# Altium schematic sheet XTAL.SchDoc
size A
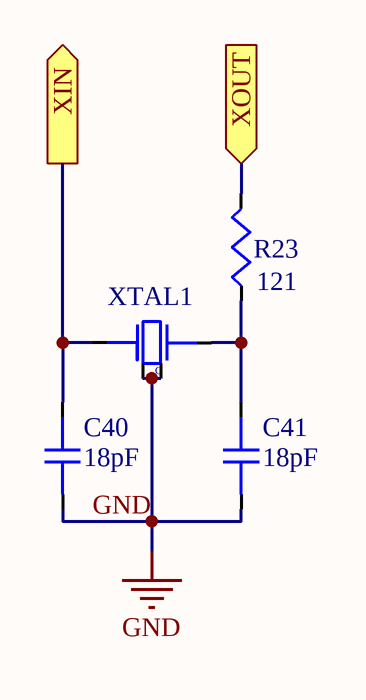
[diagram p0: XTAL.SchDoc]

## Parts
C40  18pF  [C0603]
C41  18pF  [C0603]
R23  121  [R0603]
XTAL1  ECS-192-12-33-AGM-TR  [XTAL_ECS-192-12-33-AGM-TR]  (value not drawn)

## Ports
XIN (out), XOUT (in)

## Nets
GND: C40.1 C41.1 XTAL1.2 XTAL1.4
XIN: C40.2 XTAL1.1 ; port XIN
XOUT: R23.2 ; port XOUT
NetC41_2: C41.2 R23.1 XTAL1.3

## Notes on the sheet
- (in symbol ECS-192-12-33-AGM-TR) G

## Library data of the parts
C40 C41 = 06035A190FAT2A: Multilayer Ceramic Capacitors MLCC - SMD/SMT 50V 18pF C0G 0603 1% Tol; Capacitance: 36pF; Supplier 1: Digi-Key; Supplier Part Number 1: 478-10293-1-ND; RoHS: Yes; Mount: Surface Mount; Case/Package: 0603; Case Code (Imperial): 0603; Case Code (Metric): 1608; Min Operating Temperature: -55°C; Max Operating Temperature: 125°C; Tolerance: 1%; Dielectric: C0G; Packaging: Tape and Reel; Package Quantity: 8000; Voltage Rating: 50V; Voltage Rating (DC): 50V; Termination: SMD/SMT; Length: 1.6mm; Depth: 0.81mm; Width: 0.81mm; Thickness: 0.035inch; Radiation Hardening: No; ComponentLink1URL: https://datasheet.ciiva.com/11567/ccog-11567927.pdf?src-supplier=Avnet; ComponentLink1Description: https://datasheet.ciiva.com/11567/ccog-11567927.pdf?src-supplier=Avnet; ComponentLink2URL: https://datasheet.ciiva.com/5423/ccog-243403-5423289.pdf?src-supplier=Mouser; ComponentLink2Description: https://datasheet.ciiva.com/5423/ccog-243403-5423289.pdf?src-supplier=Mouser; ComponentLink3URL: https://datasheet.ciiva.com/17492/ccog-17492554.pdf?src-supplier=Avnet+Europe; ComponentLink3Description: https://datasheet.ciiva.com/17492/ccog-17492554.pdf?src-supplier=Avnet+Europe; ComponentLink4URL: https://datasheet.ciiva.com/209/ccog-209692.pdf?src-supplier=Digi-Key; ComponentLink4Description: https://datasheet.ciiva.com/209/ccog-209692.pdf?src-supplier=Digi-Key
R23 = RP73PF1J121RBTDF: TE CONNECTIVITY         RP73PF1J121RBTDF             SMD Chip Resistor, Thin Film, 121 ohm, 100 V, 0603 [1608 Metric], 166 mW,  0.1%, RN73 Series; Resistance: 121R; Power Rating: 166mW; Voltage Rating: 100V; Max Power Dissipation: 167mW; Temperature Coefficient: 25ppm/°C; Supplier 1: Digi-Key; Supplier Part Number 1: A110020CT-ND; Manufacturer 1: TE Connectivity; Manufacturer Part Number 1: RP73PF1J121RBTDF; Stock 1: 850; Pricing 1: 1=0.66000, 10=0.48500, 100=0.28230 (USD); RoHS: Yes; Mount: Surface Mount; Case/Package: 0603; Case Code (Metric): 1608; Case Code (Imperial): 0603; Min Operating Temperature: -55°C; Max Operating Temperature: 155°C; Tolerance: 0.1%; Package Quantity: 1000; Packaging: Tape and Reel; Composition: Thin Film; Number of Terminations: 2; Termination: Solder; Voltage Rating (DC): 100V; Length: 0.061inch; Height: 0.022inch; Width: 0.031inch; Depth: 0.8mm; REACH SVHC: No SVHC; ComponentLink1URL: https://datasheet.ciiva.com/7801/1635325-7801605.pdf?src-supplier=Element14; ComponentLink1Description: https://datasheet.ciiva.com/7801/1635325-7801605.pdf?src-supplier=Element14; ComponentLink2URL: https://datasheet.ciiva.com/18601/eng-ds-1773272-j-18601303.pdf?src-supplier=Digi-Key; ComponentLink2Description: https://datasheet.ciiva.com/18601/eng-ds-1773272-j-18601303.pdf?src-supplier=Digi-Key; ComponentLink3URL: https://datasheet.ciiva.com/18601/eng-ds-1773272-j-18601304.pdf?src-supplier=Digi-Key; ComponentLink3Description: https://datasheet.ciiva.com/18601/eng-ds-1773272-j-18601304.pdf?src-supplier=Digi-Key; ComponentLink4URL: https://datasheet.ciiva.com/18601/eng-ds-1773272-j-18601305.pdf?src-supplier=Digi-Key; ComponentLink4Description: https://datasheet.ciiva.com/18601/eng-ds-1773272-j-18601305.pdf?src-supplier=Digi-Key
XTAL1 = ECS-192-12-33-AGM-TR: Crystal 19.2MHz ±25ppm (Tol) ±30ppm (Stability) 12pF FUND 80Ohm 4-Pin Mini-CSMD T/R; Manufacturer 1: ECS International; Supplier 1: Digi-Key; Supplier Part Number 1: XC2452CT-ND; Manufacturer Part Number 1: ECS-192-12-33-AGM-TR; Stock 1: 1382; Pricing 1: 1=0.56000, 10=0.46500, 50=0.41820, 100=0.37180, 500=0.35322 (USD)